# Altium project Tube02.PrjPCB
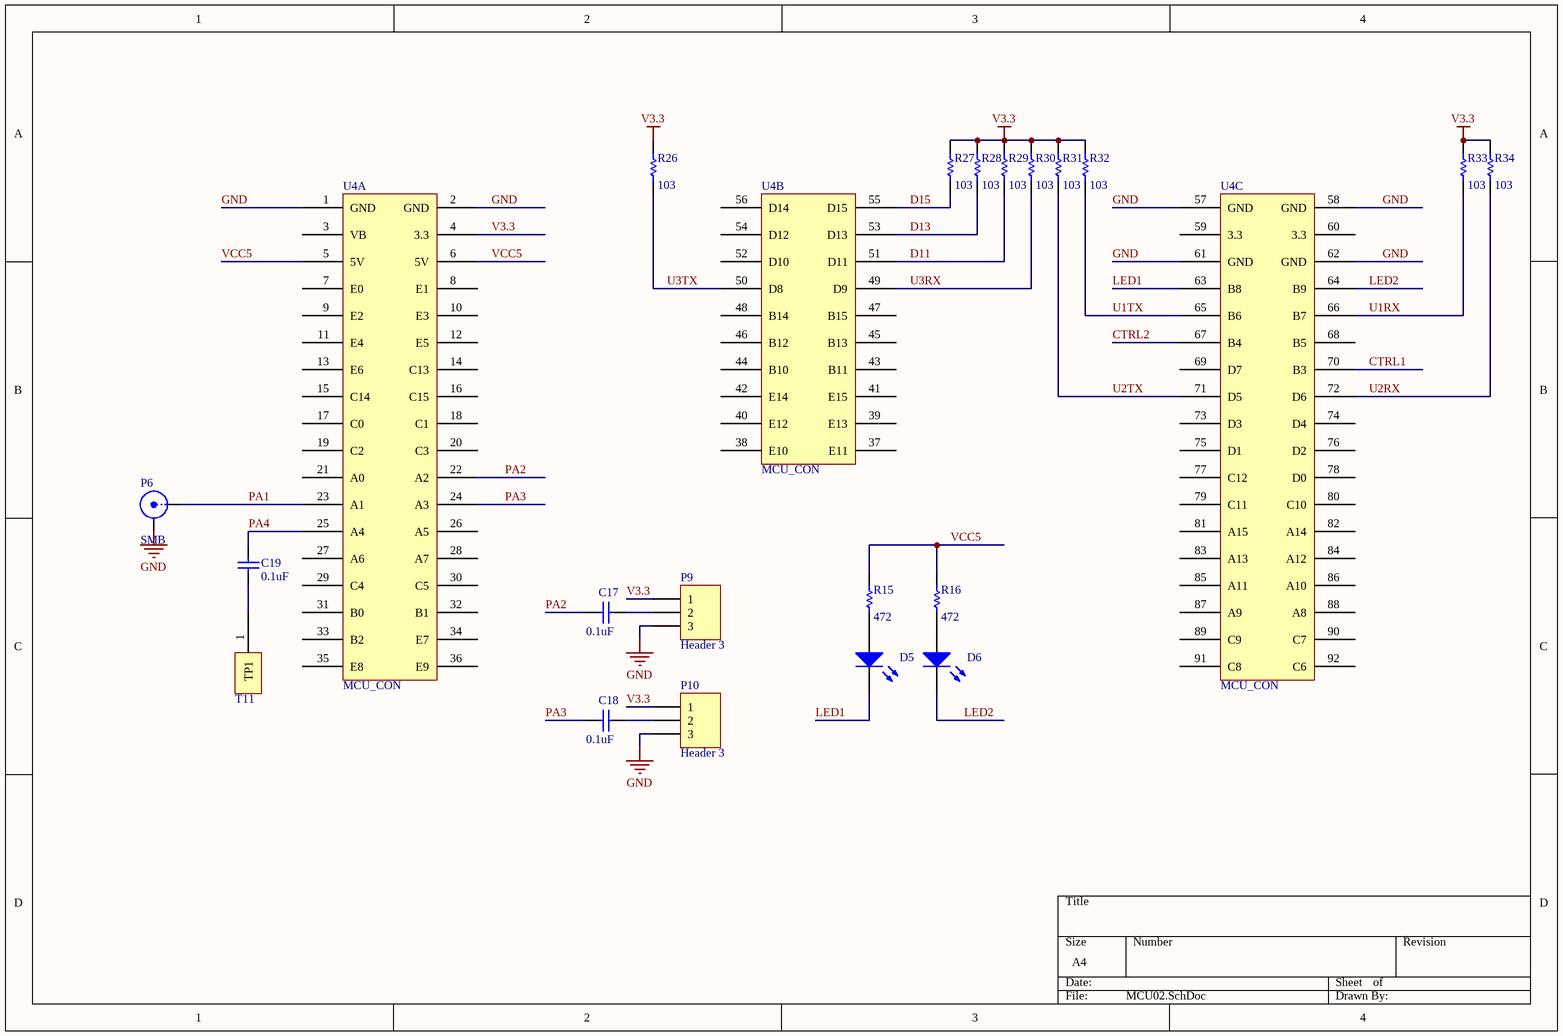
[diagram p0: MCU02.SchDoc]
2 sheets, 47 parts. Net scope: global (net labels, ports and power ports of the same name join across sheets).
Board file: Tube02.PcbDoc
Sheets:
  MCU02.SchDoc
  Power02.SchDoc

## Sheet MCU02.SchDoc
size A4

### Parts
C17  value 0.1uF  [1206]  (hidden comment: Cap Semi)
C18  value 0.1uF  [1206]  (hidden comment: Cap Semi)
C19  value 0.1uF  [1206]  (hidden comment: Cap Semi)
D5  LED2  [0805_led]  (value not drawn)
D6  LED2  [0805_led]  (value not drawn)
P6  SMB  [SMB_V-RJ45]
P9  Header 3  [HDR1X3]
P10  Header 3  [HDR1X3]
R15  value 472  [1206]  (hidden comment: Res Semi)
R16  value 472  [1206]  (hidden comment: Res Semi)
R26  value 103  [1206]  (hidden comment: Res Semi)
R27  value 103  [1206]  (hidden comment: Res Semi)
R28  value 103  [1206]  (hidden comment: Res Semi)
R29  value 103  [1206]  (hidden comment: Res Semi)
R30  value 103  [1206]  (hidden comment: Res Semi)
R31  value 103  [1206]  (hidden comment: Res Semi)
R32  value 103  [1206]  (hidden comment: Res Semi)
R33  value 103  [1206]  (hidden comment: Res Semi)
R34  value 103  [1206]  (hidden comment: Res Semi)
T11  TP1  [TP1]  (value not drawn)
U4  MCU_CON  [MCU_CON]  (parts A,B,C of 3)

### Nets
GND: P6.2(Y) P9.3 P10.3 U4.1(GND) U4.2(GND) U4.57(GND) U4.58(GND) U4.61(GND) U4.62(GND)
V3.3: P9.1 P10.1 R26.2 R27.2 R28.2 R29.2 R30.2 R31.2 R32.2 R33.2 R34.2 U4.4(3.3)
CTRL1: U4.70(B3)
CTRL2: U4.67(B4)
D11: R29.1 U4.51(D11)
D13: R28.1 U4.53(D13)
D15: R27.1 U4.55(D15)
LED1: D5.2(K) U4.63(B8)
LED2: D6.2(K) U4.64(B9)
PA1: P6.1(X) U4.23(A1)
PA2: C17.1 U4.22(A2)
PA3: C18.1 U4.24(A3)
PA4: C19.2 U4.25(A4)
U1RX: R33.1 U4.66(B7)
U1TX: R32.1 U4.65(B6)
U2RX: R34.1 U4.72(D6)
U2TX: R31.1 U4.71(D5)
U3RX: R30.1 U4.49(D9)
U3TX: R26.1 U4.50(D8)
VCC5: R15.2 R16.2 U4.5(5V) U4.6(5V)
NetC17_2: C17.2 P9.2
NetC18_2: C18.2 P10.2
NetC19_1: C19.1 T11.1(TP1)
NetD5_1: D5.1(A) R15.1
NetD6_1: D6.1(A) R16.1

Not connected (* = marked no-connect by the designer): U4 3(VB) 7(E0) 8(E1) 9(E2) 10(E3) 11(E4) 12(E5) 13(E6) 14(C13) 15(C14) 16(C15) 17(C0) 18(C1) 19(C2) 20(C3) 21(A0) 26(A5) 27(A6) 28(A7) 29(C4) 30(C5) 31(B0) 32(B1) 33(B2) 34(E7) 35(E8) 36(E9) 37(E11) 38(E10) 39(E13) 40(E12) 41(E15) 42(E14) 43(B11) 44(B10) 45(B13) 46(B12) 47(B15) 48(B14) 52(D10) 54(D12) 56(D14) 59(3.3) 60(3.3) 68(B5) 69(D7) 73(D3) 74(D4) 75(D1) 76(D2) 77(C12) 78(D0) 79(C11) 80(C10) 81(A15) 82(A14) 83(A13) 84(A12) 85(A11) 86(A10) 87(A9) 88(A8) 89(C9) 90(C7) 91(C8) 92(C6)

### Library data of the parts
C17-C19 = Cap Semi: Capacitor (Semiconductor SIM Model); Published: 8-Jun-2000; LatestRevisionDate: 29-May-2009; LatestRevisionNote: IPC-7351 Footprint Added.; PackageReference: C1206; Publisher: Altium Limited; PackageDescription: Chip Capacitor
D5 D6 = LED2: Typical RED, GREEN, YELLOW, AMBER GaAs LED; Published: 8-Jun-2000; LatestRevisionDate: 17-Jul-2002; LatestRevisionNote: Re-released for DXP Platform.; PackageVersion: Feb-2002; PackageReference: 3.2X1.6X1.1; Publisher: Altium Limited
P6 = SMB: SMB Straight Connector; LatestRevisionDate: 17-Jul-2002; LatestRevisionNote: Re-released for DXP Platform.; Publisher: Altium Limited
P9 P10 = Header 3: Header, 3-Pin; LatestRevisionDate: 17-Jul-2002; LatestRevisionNote: Re-released for DXP Platform.; Publisher: Altium Limited
R15 R16 R26-R34 = Res Semi: Semiconductor Resistor; Published: 8-Jun-2000; LatestRevisionDate: 17-Jul-2002; LatestRevisionNote: Re-released for DXP Platform.; PackageReference: AXIAL-0.5; Publisher: Altium Limited

## Sheet Power02.SchDoc
size A4
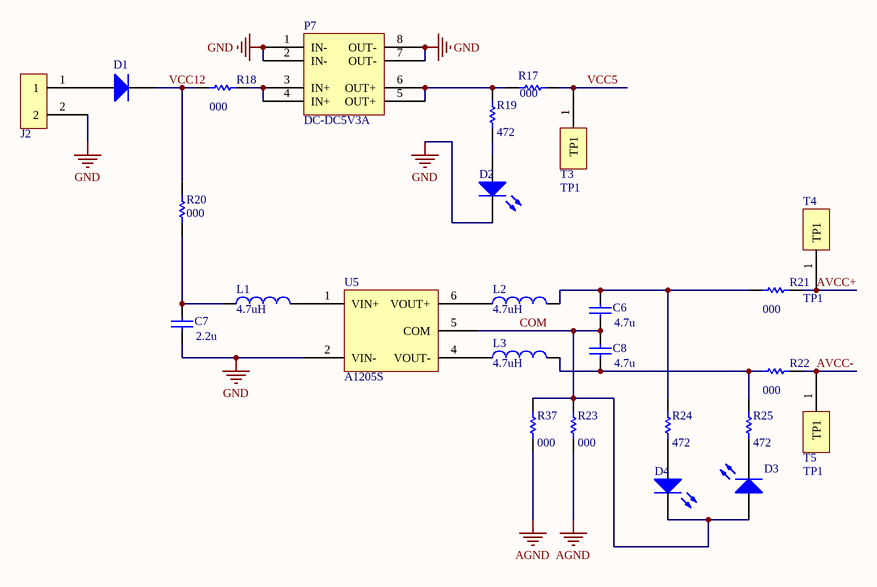
[diagram p1: Power02.SchDoc]

### Parts
C6  value 4.7u  [1206]  (hidden comment: Cap Semi)
C7  value 2.2u  [1206]  (hidden comment: Cap Semi)
C8  value 4.7u  [1206]  (hidden comment: Cap Semi)
D1  LED2  [1206]  (value not drawn)
D2  LED2  [0805_LED]  (value not drawn)
D3  LED2  [0805_LED]  (value not drawn)
D4  LED2  [0805_LED]  (value not drawn)
J2  XK7.62-2P  [XK7.62-2P]  (value not drawn)
L1  value 4.7uH  [1206]  (hidden comment: Inductor)
L2  value 4.7uH  [1206]  (hidden comment: Inductor)
L3  value 4.7uH  [1206]  (hidden comment: Inductor)
P7  DC-DC5V3A  [DC-DC3A]
R17  value 000  [1206]  (hidden comment: Res Semi)
R18  value 000  [1206]  (hidden comment: Res Semi)
R19  value 472  [1206]  (hidden comment: Res Semi)
R20  value 000  [1206]  (hidden comment: Res Semi)
R21  value 000  [1206]  (hidden comment: Res Semi)
R22  value 000  [1206]  (hidden comment: Res Semi)
R23  value 000  [1206]  (hidden comment: Res Semi)
R24  value 472  [1206]  (hidden comment: Res Semi)
R25  value 472  [1206]  (hidden comment: Res Semi)
R37  value 000  [1206]  (hidden comment: Res Semi)
T3  TP1  [TP1]
T4  TP1  [TP1]
T5  TP1  [TP1]
U5  A1205S  [A1205S]

### Nets
AGND: R23.1 R37.1
GND: C7.1 D2.2(K) J2.2 P7.1(IN-) P7.2(IN-) P7.7(OUT-) P7.8(OUT-) U5.2(VIN-)
AVCC+: R21.2 T4.1(TP1)
AVCC-: R22.2 T5.1(TP1)
COM: C6.1 C8.2 D3.1(A) D4.2(K) R23.2 R37.2 U5.5(COM)
VCC5: R17.2 T3.1(TP1)
VCC12: D1.2(K) R18.1 R20.2
NetC6_2: C6.2 L2.2 R21.1 R24.2
NetC7_2: C7.2 L1.1 R20.1
NetC8_1: C8.1 L3.2 R22.1 R25.2
NetD1_1: D1.1(A) J2.1
NetD2_1: D2.1(A) R19.1
NetD3_2: D3.2(K) R25.1
NetD4_1: D4.1(A) R24.1
NetL1_2: L1.2 U5.1(VIN+)
NetL2_1: L2.1 U5.6(VOUT+)
NetL3_1: L3.1 U5.4(VOUT-)
NetP7_3: P7.3(IN+) P7.4(IN+) R18.2
NetP7_5: P7.5(OUT+) P7.6(OUT+) R17.1 R19.2

### Library data of the parts
C6-C8 = Cap Semi: Capacitor (Semiconductor SIM Model); Published: 8-Jun-2000; LatestRevisionDate: 29-May-2009; LatestRevisionNote: IPC-7351 Footprint Added.; PackageReference: C1206; Publisher: Altium Limited; PackageDescription: Chip Capacitor
D1 = Diode 1N4001: 1 Amp General Purpose Rectifier; Published: 8-Jun-2000; LatestRevisionDate: 17-Jul-2002; LatestRevisionNote: Re-released for DXP Platform.; DatasheetVersion: 1998; PackageVersion: Aug-1999; PackageReference: DO-41; Publisher: Altium Limited; Code_JEDEC: DO-204-AL; ComponentLink1Description: Manufacturer Link; ComponentLink1URL: http://www.fairchildsemi.com/; ComponentLink2Description: Datasheet; ComponentLink2URL: http://www.fairchildsemi.com/ds/1N%2F1N4001.pdf
D2-D4 = LED2: as D5 on sheet MCU02; Published: 8-Jun-2000; LatestRevisionDate: 17-Jul-2002; LatestRevisionNote: Re-released for DXP Platform.; PackageVersion: Feb-2002; PackageReference: 3.2X1.6X1.1; Publisher: Altium Limited
L1-L3 = Inductor: Code_IEC: 1005; Published: 8-Jun-2000; LatestRevisionDate: 29-May-2009; LatestRevisionNote: IPC-7351 Footprint Added.; PackageReference: 0402-A; Publisher: Altium Limited; PackageDescription: Chip Inductor; Code_JEITA: 0402
P7 = DC-DC3A
R17-R25 R37 = Res Semi: Semiconductor Resistor; Published: 8-Jun-2000; LatestRevisionDate: 17-Jul-2002; LatestRevisionNote: Re-released for DXP Platform.; PackageReference: AXIAL-0.5; Publisher: Altium Limited

## Nets that join several sheets
GND: MCU02 (9 pins), Power02 (8 pins)
VCC5: MCU02 (R15.2 R16.2 U4.5 U4.6), Power02 (R17.2 T3.1)